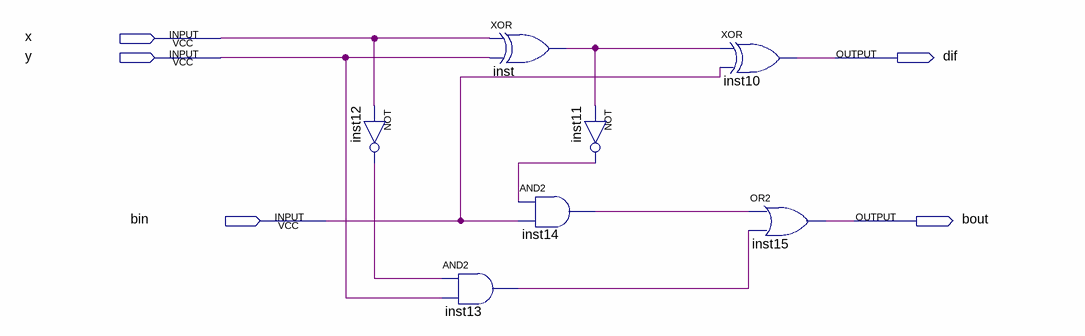
[diagram p0: schematic sheet]
// Quartus schematic aula07.bdf as structural Verilog: 7 symbols, 5 pins
module aula07 (
  input  x,
  input  y,
  input  bin,
  output dif,
  output bout
);

  wire inst11_out, inst12_out, inst13_out, inst14_out, inst_out;

  not inst12 (inst12_out, x);
  and inst13 (inst13_out, inst12_out, y);
  xor inst (inst_out, x, y);
  and inst14 (inst14_out, inst11_out, bin);
  not inst11 (inst11_out, inst_out);
  xor inst10 (dif, inst_out, bin);
  or inst15 (bout, inst14_out, inst13_out);
endmodule
